# Altium schematic sheet Display.SchDoc
size A4; SheetNumber: 10; SheetTotal: 11
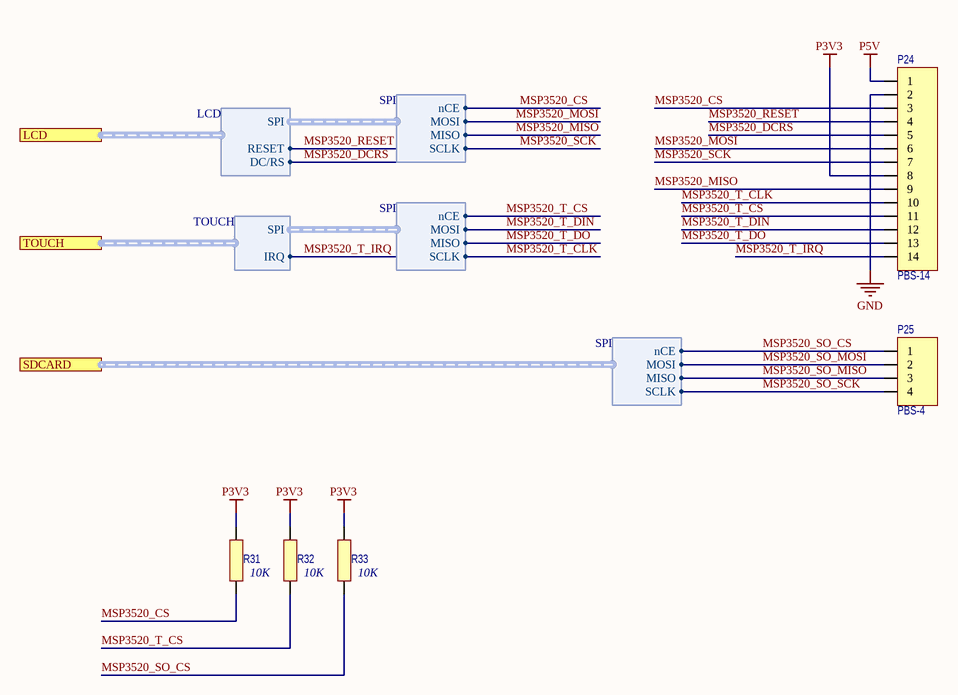
[diagram p0: Display.SchDoc]

## Parts
P24  PBS-14  [PBS-14]
P25  PBS-4  [PBS-4]
R31  value 10K  [R0805]  (hidden comment: R0805)
R32  value 10K  [R0805]  (hidden comment: R0805)
R33  value 10K  [R0805]  (hidden comment: R0805)

## Ports
LCD (harness LCD), SDCARD (harness SPI), TOUCH (harness TOUCH)

## Harnesses
SPI: nCE, MISO, MOSI, SCLK
LCD: SPI, RESET, DC/RS
TOUCH: SPI, IRQ

## Nets
GND: P24.2
P3V3: P24.8 R31.2 R32.2 R33.2
P5V: P24.1
MSP3520_CS: P24.3 R31.1 ; harness SPI.nCE
MSP3520_DCRS: P24.5 ; port LCD.DC/RS
MSP3520_MISO: P24.9 ; harness SPI.MISO
MSP3520_MOSI: P24.6 ; harness SPI.MOSI
MSP3520_RESET: P24.4 ; port LCD.RESET
MSP3520_SCK: P24.7 ; harness SPI.SCLK
MSP3520_SO_CS: P25.1 R33.1 ; port SDCARD.nCE
MSP3520_SO_MISO: P25.3 ; port SDCARD.MISO
MSP3520_SO_MOSI: P25.2 ; port SDCARD.MOSI
MSP3520_SO_SCK: P25.4 ; port SDCARD.SCLK
MSP3520_T_CLK: P24.10 ; harness SPI.SCLK
MSP3520_T_CS: P24.11 R32.1 ; harness SPI.nCE
MSP3520_T_DIN: P24.12 ; harness SPI.MOSI
MSP3520_T_DO: P24.13 ; harness SPI.MISO
MSP3520_T_IRQ: P24.14 ; port TOUCH.IRQ

## Library data of the parts
R31-R33 = R0805: Case: *; Mount: *; PartNumber: *; Power: *; Tolerance: *